# Altium schematic sheet PowerCircuit.SchDoc
size A4
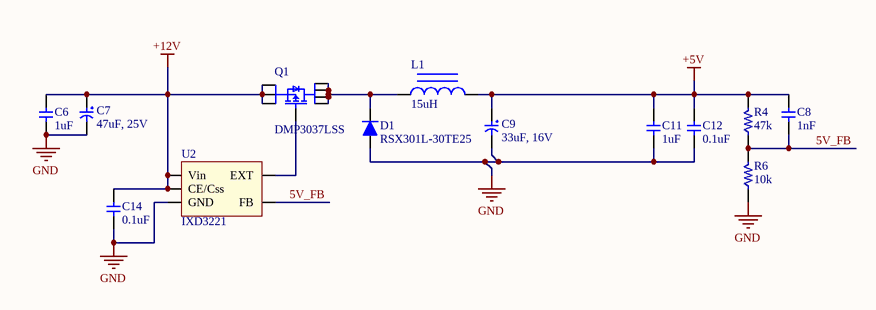
[diagram p0: PowerCircuit.SchDoc]

## Parts
C6  value 1uF  [0805]  (hidden comment: Generic Capacitor)
C7  47uF, 25V  [Cap 6.3mm dia 5.4mm Height]
C8  value 1nF  [0805]  (hidden comment: Generic Capacitor)
C9  33uF, 16V  [Cap 6.3mm dia 5.4mm Height]
C11  value 1uF  [0805]  (hidden comment: Generic Capacitor)
C12  value 0.1uF  [0805]  (hidden comment: Generic Capacitor)
C14  value 0.1uF  [0805]  (hidden comment: Generic Capacitor)
D1  RSX301L-30TE25  [SMA_diode]
L1  15uH  [SRN8040]
Q1  DMP3037LSS  [SOIC-8-PP]
R4  value 47k  [0805]  (hidden comment: Resistor)
R6  value 10k  [0805]  (hidden comment: Resistor)
U2  IXD3221  [SOT23-5]

## Nets
+5V: C8.1 C9.1 C11.1 C12.1 L1.2 R4.2
+12V: C6.2 C7.1 C14.1 Q1.1(S) Q1.2(S) Q1.3(S) U2.1(CE/Css) U2.5(Vin)
GND: C6.1 C7.2 C9.2 C11.2 C12.2 C14.2 D1.1 R6.1 U2.2(GND)
5V_FB: C8.2 R4.1 R6.2 U2.3(FB)
NetD1_2: D1.2 L1.1 Q1.5(D) Q1.6(D) Q1.7(D) Q1.8(D)
NetQ1_4: Q1.4(G) U2.4(EXT)

## Library data of the parts
C6 C8 C11 C12 C14 = Capacitor
C7 = 865080443007: Polorised capacitor 47uF, 25V; Supplier: Digikey; Supplier PN: 732-8435-1-ND; Value: 47uF
C9 = 865060343003: Polorised capacitor 33uF, 16V; Supplier: Digikey; Supplier PN: 732-8520-1-ND; Value: 33uF
D1 = RSX301L-30TE25: DIODE SCHOTTKY 30V 3A; Supplier: DigiKey; Supplier PN: RSX301L-30TE25CT-ND
L1 = SRN8040-150MCT: INDUCTOR 15uH 2.4A 70mOHMS SMD; Supplier: DigiKey; Supplier PN: SRN8040-150MCT-ND; Value: 15uH
Q1 = DMP3037LSS: P-CHANNEL ENHANCEMENT MODE MOSFET; Supplier: Digikey; Supplier PN: DMP3037LSS-13DICT-ND
R4 R6 = Resistor: Generic Resistor
U2 = IXD3221: IC REG CTRLR BUCK SOT25; Supplier: Digikey; Supplier PN: 269-4974-1-ND